# EAGLE design Word Clock (EAGLE 7.2.0)
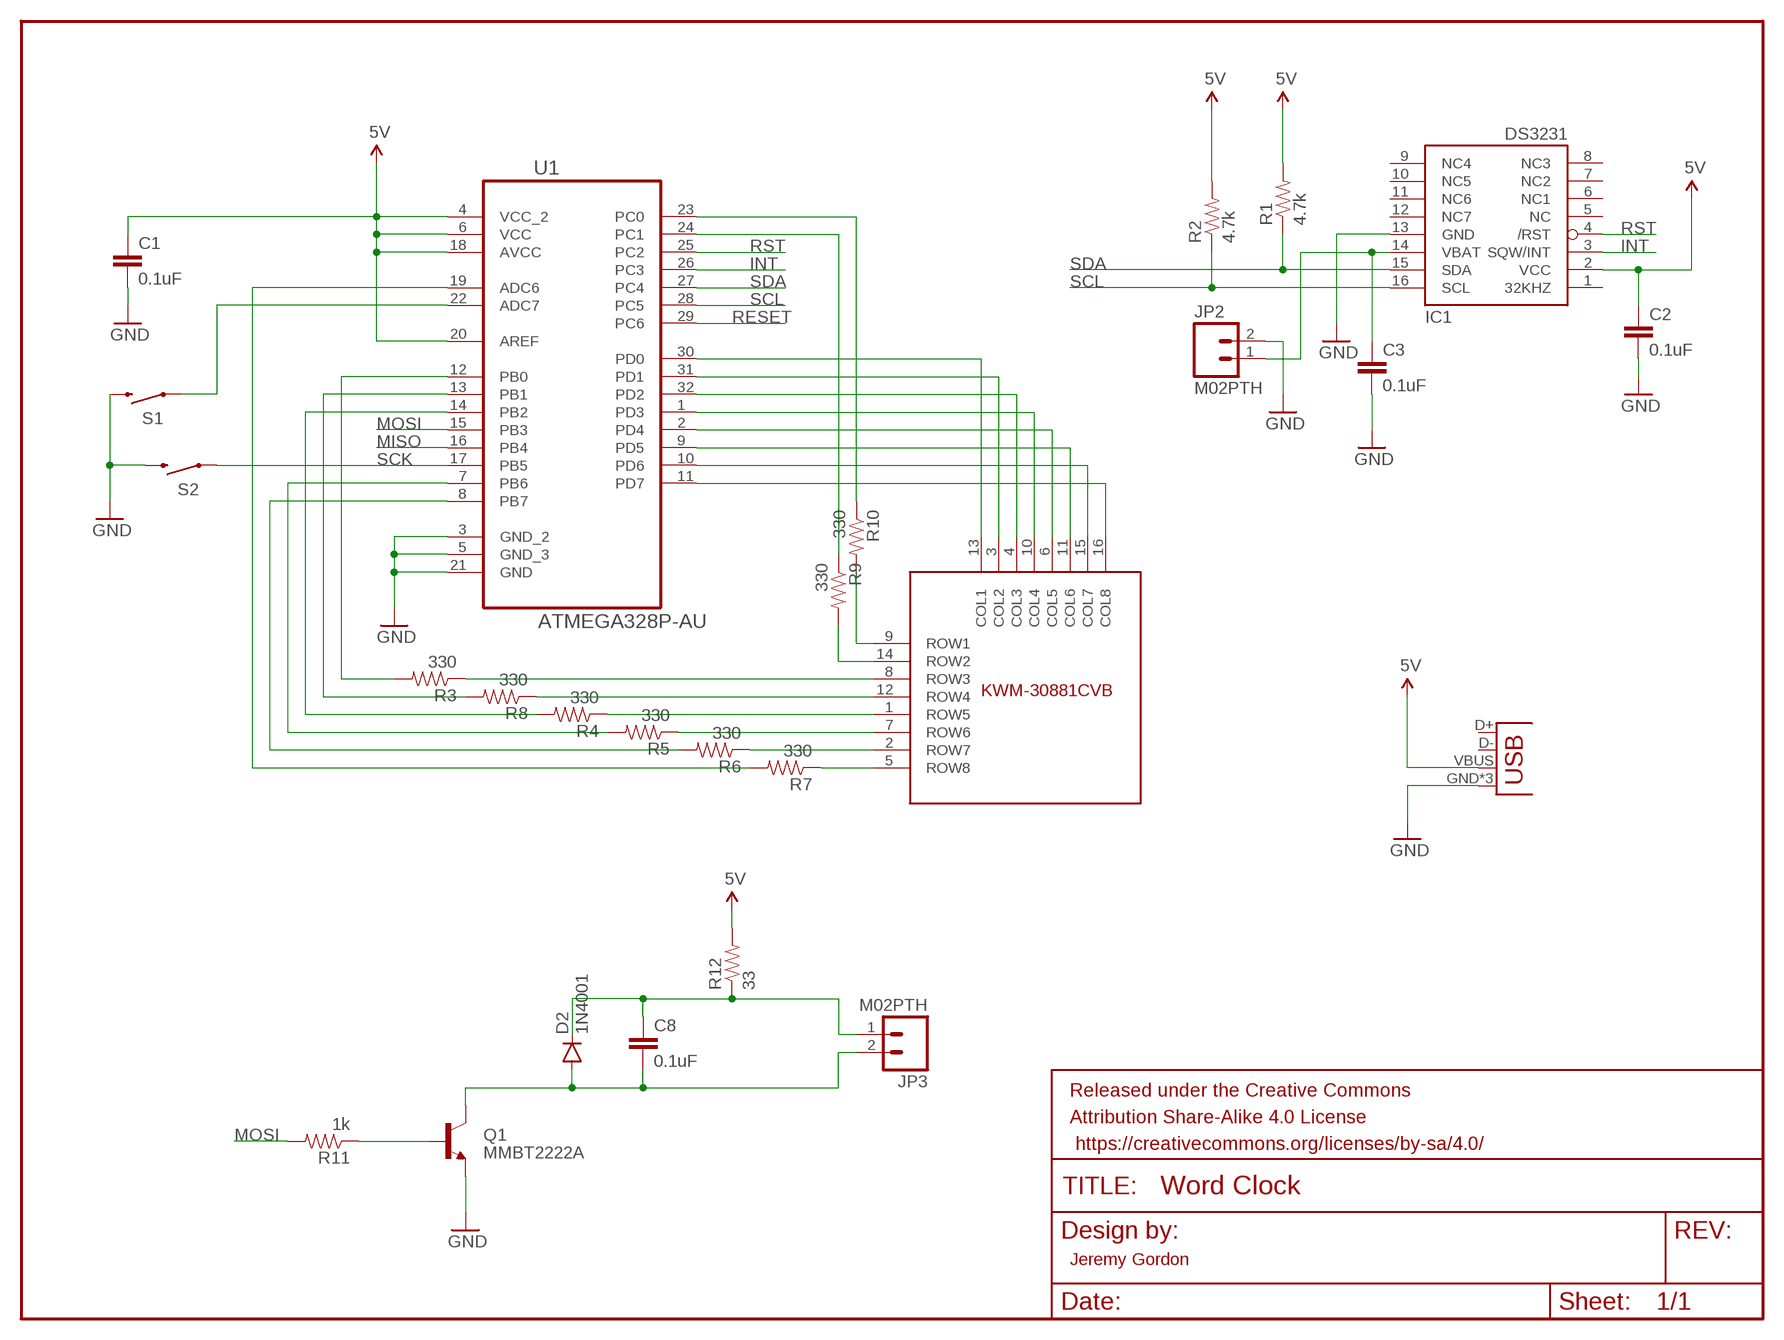
[diagram p0: schematic, sheet 1]

## Parts
C1  0.1uF  CAP0805  [0805]
C2  0.1uF  CAP0805  [0805]
C3  0.1uF  CAP0805  [0805]
C8  0.1uF  CAP0805  [0805]
D1  KWM-30881CVB  [KWM-30881CVB]
D2  1N4001  DIODESOD  [SOD-323]
FRAME1  FRAME-LETTER  [CREATIVE_COMMONS]
IC1  DS3231/SO  [SO16W]
JP1  USB-MICROB  [USB-MICROB]
JP2  M02PTH  [1X02]
JP3  M02PTH  [1X02]
Q1  MMBT2222A  TRANSISTOR_NPNMMBT2222A  [SOT23-3]
R1  4.7k  RESISTOR0805-RES  [0805]
R2  4.7k  RESISTOR0805-RES  [0805]
R3  330  RESISTOR0805-RES  [0805]
R4  330  RESISTOR0805-RES  [0805]
R5  330  RESISTOR0805-RES  [0805]
R6  330  RESISTOR0805-RES  [0805]
R7  330  RESISTOR0805-RES  [0805]
R8  330  RESISTOR0805-RES  [0805]
R9  330  RESISTOR0805-RES  [0805]
R10  330  RESISTOR0805-RES  [0805]
R11  1k  RESISTOR0805-RES  [0805]
R12  33  RESISTOR0805-RES  [0805]
S1  SWITCH-MOMENTARY-2SMD-1101NE  [TACTILE-SWITCH-1101NE]
S2  SWITCH-MOMENTARY-2SMD-1101NE  [TACTILE-SWITCH-1101NE]
U1  ATMEGA328P-AU  [QFP80P900X900X120-32N]

## Nets
5V: C1.1 C2.1 IC1.2(VCC) JP1.VBUS R1.2 R2.2 R12.2 U1.4(VCC_2) U1.6(VCC) U1.18(AVCC) U1.20(AREF)
GND: C1.2 C2.2 C3.2 IC1.13(GND) JP1.GND JP1.MT1(GND) JP1.MT2(GND) JP2.2 Q1.2(E) S1.2 S2.2 U1.3(GND_2) U1.5(GND_3) U1.21(GND)
INT: IC1.3(SQW/INT) U1.26(PC3)
MISO: U1.16(PB4)
MOSI: R11.2 U1.15(PB3)
N$1: D1.13(COL1) U1.30(PD0)
N$2: D1.3(COL2) U1.31(PD1)
N$3: D1.4(COL3) U1.32(PD2)
N$4: D1.10(COL4) U1.1(PD3)
N$5: D1.6(COL5) U1.2(PD4)
N$6: D1.11(COL6) U1.9(PD5)
N$7: D1.15(COL7) U1.10(PD6)
N$8: D1.16(COL8) U1.11(PD7)
N$9: R9.1 U1.24(PC1)
N$10: R10.1 U1.23(PC0)
N$11: R3.2 U1.12(PB0)
N$12: R8.2 U1.13(PB1)
N$13: R4.2 U1.14(PB2)
N$14: R5.2 U1.7(PB6)
N$15: R6.2 U1.8(PB7)
N$16: R7.2 U1.19(ADC6)
N$17: C3.1 IC1.14(VBAT) JP2.1
N$18: S1.1 U1.22(ADC7)
N$19: D1.8(ROW3) R3.1
N$20: D1.12(ROW4) R8.1
N$21: D1.1(ROW5) R4.1
N$22: D1.7(ROW6) R5.1
N$23: D1.2(ROW7) R6.1
N$24: D1.5(ROW8) R7.1
N$25: D1.9(ROW1) R10.2
N$26: D1.14(ROW2) R9.2
N$27: Q1.1(B) R11.1
N$28: C8.1 D2.C JP3.1 R12.1
N$29: C8.2 D2.A JP3.2 Q1.3(C)
RESET: U1.29(PC6)
RST: IC1.4(/RST) U1.25(PC2)
SCK: S2.1 U1.17(PB5)
SCL: IC1.16(SCL) R2.1 U1.28(PC5)
SDA: IC1.15(SDA) R1.1 U1.27(PC4)
Unconnected: IC1.1(32KHZ) IC1.5(NC) IC1.6(NC1) IC1.7(NC2) IC1.8(NC3) IC1.9(NC4) IC1.10(NC5) IC1.11(NC6) IC1.12(NC7) JP1.D+ JP1.D-

## Notes on the sheet
- Jeremy Gordon

## Library data of the parts
C1-C3 C8 = SparkFun-Capacitors:CAP: Capacitor Standard 0603 ceramic capacitor, and 0.1" leaded capacitor.
D1 = KWM-30881XVB:KWM-30881CVB
D2 = SparkFun-DiscreteSemi:DIODE: Diode These are standard reverse protection diodes and small signal diodes. SMA package can handle up to about 1A. SOD-323 can handle about 200mA. What the SOD-323 package when ordering, there are some mfgs out there that are 5-pin packages.; PROD_ID: DIO-09646
FRAME1 = SparkFun-Aesthetics:FRAME-LETTER: Schematic Frame Standard 8.5x11 US Letter frame
IC1 = adafruit:DS3231
JP1 = SparkFun-Connectors:USB: USB Connectors USB-B-PTH is fully proven SKU : PRT-00139/CONN-08278 USB-miniB is fully proven SKU : PRT-00587 USB-A-PCB is untested. USB-A-H is throughly reviewed, but untested. Spark Fun Electronics SKU : PRT-00437 USB-B-SMT is throughly reviewed, but untested. Needs silkscreen touching up. USB-A-S has not been used/tested USB-MB-H has not been used/tested USB-MICROB has been used. CONN-09505; PROD_ID: CONN-09505
JP2 JP3 = SparkFun-Connectors:M02: Standard 2-pin 0.1" header. Use with - straight break away headers ( PRT-00116) - right angle break away headers (PRT-00553) - swiss pins (PRT-00743) - machine pins (PRT-00117) - female headers (PRT-00115) Molex polarized connector foot print use with: PRT-08233 with associated crimp pins and housings. 2.54_SCREWTERM for use with PRT-10571. 3.5mm Screw Terminal footprints for PRT-08084 5mm Screw Terminal footprints for use with PRT-08432
Q1 = SparkFun-DiscreteSemi:TRANSISTOR_NPN: Generic NPN BJT MMBT2222A - TRANS-08049 (SOT-23, 1A 40V) MPSA42 - TRANS-09116 (SOT-23, 500mA 300V) MMBT5088LT1G - TRANS-11160 (SOT-23, 50 mA 30V) BC547 - COM-08928 <http://www.sparkfun.com/products/8928> (TO-92 45V 100mA) (1.Collector 2.Base 3.Emitter) 2N3904 - COM-00521 <http://www.sparkfun.com/products/521> (TO-92 40V 200mA) (1.Emitter 2.Base 3.Collector) P2N2222A - COM-12852 <http://www.sparkfun.com/products/12852> (TO-92 40V 600mA) (1.Collector 2.Base 3.Emitter); PROD_ID: TRANS-08049
R1-R12 = SparkFun-Resistors:RESISTOR: Resistor Basic schematic elements and footprints for 0603, 1206, and PTH resistors.
S1 S2 = SparkFun-Electromechanical:SWITCH-MOMENTARY-2: Various NO switches- pushbuttons, reed, etc; PROD_ID: SWCH-00815
U1 = Atmel_By_element14_Batch_1-00:ATMEGA328P-AU: 8-bit Microcontroller with In-System Programmable Flash; MPN: ATMEGA328P-AU; OC_FARNELL: 1715486; OC_NEWARK: 14R4631; PACKAGE: TQFP-32; SUPPLIER: Atmel

## Board
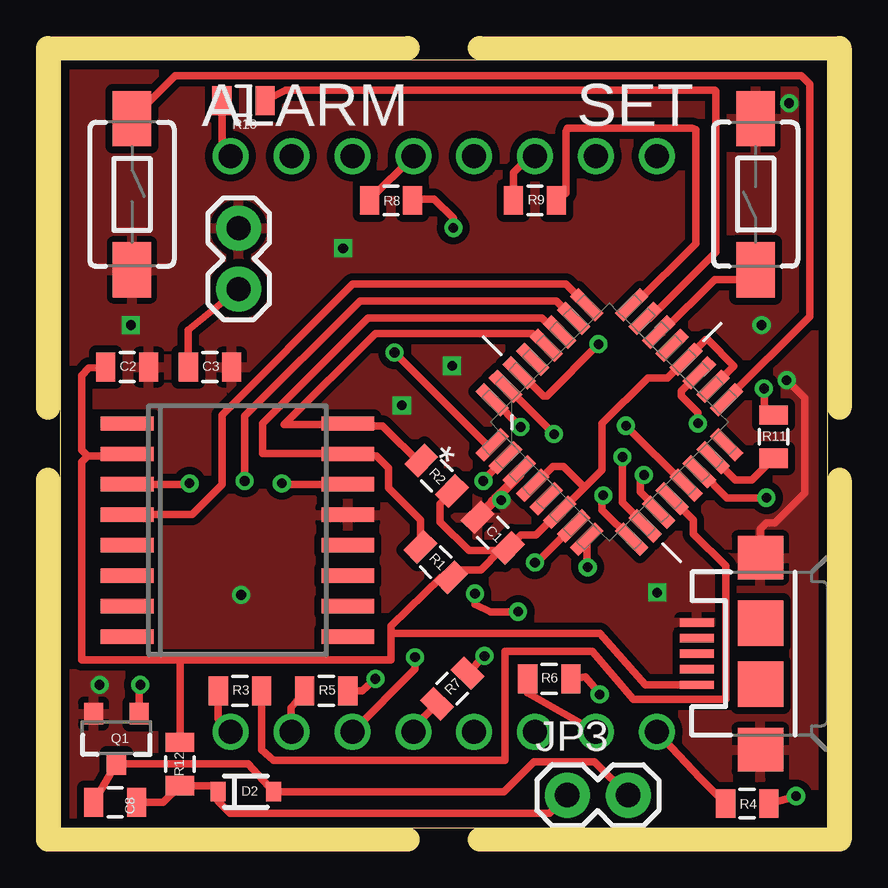
[diagram p1: board, top side]
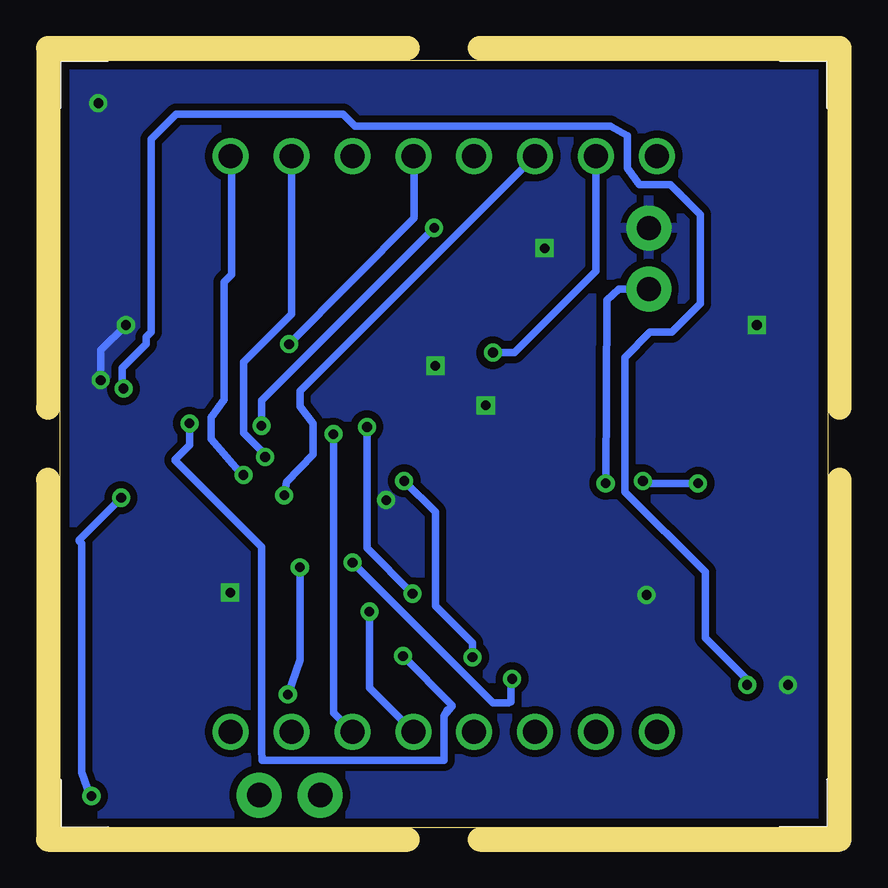
[diagram p2: board, bottom side, seen from below]

Size 32 x 32 mm. Coordinates in mm from the lower left corner, seen from the top.
Outline: 0,0 32,0 32,32 0,32 0,0
Copper layers (1*16): Top 0.0356mm / dielectric 1.5011mm / Bottom 0.0356mm
Design rules "LaenPCBOrder *": minimum track width 6mil, minimum drill 13mil, track to track 8mil, track to pad 8mil, pad to pad 8mil, via to via 8mil, smd to smd 8mil, copper to edge 15mil, drill to drill 6mil, minimum pad ring 7mil, minimum via ring 7mil, stop-mask expansion 3mil, vias tented up to drill 0mil, thermal gap 10mil
Milling: 8 lines

### Footprints (pad centres in the part's own frame; a part is rotated, then mirrored left to right if it is on the bottom)
0805 = smd 0.8 x 1.2: 1 -0.9,0; 2 0.9,0
KWM-30881CVB = drill 1: 1 -8.89,-12; 2 -6.35,-12; 3 -3.81,-12; 4 -1.27,-12; 5 1.27,-12; 6 3.81,-12; 7 6.35,-12; 8 8.89,-12; 9 8.89,12; 10 6.35,12; 11 3.81,12; 12 1.27,12; 13 -1.27,12; 14 -3.81,12; 15 -6.35,12; 16 -8.89,12
SOD-323 = smd 0.63 x 0.83: A 1.15,0; C -1.15,0
SO16W = smd 0.6 x 2.2: 1 -4.445,-4.6; 2 -3.175,-4.6; 3 -1.905,-4.6; 4 -0.635,-4.6; 5 0.635,-4.6; 6 1.905,-4.6; 7 3.175,-4.6; 8 4.445,-4.6; 9 4.445,4.6; 10 3.175,4.6; 11 1.905,4.6; 12 0.635,4.6; 13 -0.635,4.6; 14 -1.905,4.6; 15 -3.175,4.6; 16 -4.445,4.6
USB-MICROB = smd 0.35 x 1.4: D+ 0,2.65; D- -0.65,2.65; GND 1.3,2.65; ID 0.65,2.65; VBUS -1.3,2.65 | smd 1.8 x 1.9: MT1 -4,0; MT2 4,0 | smd 1.9 x 1.9: P$1 -1.27,0; P$2 1.27,0
1X02 = drill 1.016 pad 1.88: 1 0,0; 2 2.54,0
SOT23-3 = smd 0.8 x 0.9: 1 -0.95,-1; 2 0.95,-1; 3 0,1.1
TACTILE-SWITCH-1101NE = smd 2.3 x 1.6: 1 -3.15,0; 2 3.15,0
QFP80P900X900X120-32N = smd 1.473 x 0.508: 1 -4.115,2.794; 2 -4.115,2.007; 3 -4.115,1.194; 4 -4.115,0.406; 5 -4.115,-0.406; 6 -4.115,-1.194; 7 -4.115,-2.007; 8 -4.115,-2.794; 17 4.115,-2.794; 18 4.115,-2.007; 19 4.115,-1.194; 20 4.115,-0.406; 21 4.115,0.406; 22 4.115,1.194; 23 4.115,2.007; 24 4.115,2.794 | smd 0.508 x 1.473: 9 -2.794,-4.115; 10 -2.007,-4.115; 11 -1.194,-4.115; 12 -0.406,-4.115; 13 0.406,-4.115; 14 1.194,-4.115; 15 2.007,-4.115; 16 2.794,-4.115; 25 2.794,4.115; 26 2.007,4.115; 27 1.194,4.115; 28 0.406,4.115; 29 -0.406,4.115; 30 -1.194,4.115; 31 -2.007,4.115; 32 -2.794,4.115

### Placement (x,y rotation side)
C1  18.05,12.3 135 top
C2  2.8,19.2 0 top
C3  6.25,19.2 0 top
C8  2.3,1.05 180 top
D1  16,16 0 bottom
D2  7.75,1.5 0 top
FRAME1  -14.47,-12.39 0 top  (outside the outline)
IC1  7.4,12.4 270 top
JP1  29.2,7.25 90 top
JP2  7.45,22.45 90 top
JP3  21.15,1.35 0 top
Q1  2.35,3.75 180 top
R1  15.66,11.07 315 top
R2  15.7,14.67 315 top
R3  7.5,5.7 0 top
R4  28.65,1 0 top
R5  11.1,5.7 0 top
R6  20.4,6.2 0 top
R7  16.35,5.8 45 top
R8  13.8,26.15 0 top
R9  19.8,26.15 180 top
R10  7.65,30.3 180 top
R11  29.75,16.3 270 top
R12  5,2.65 90 top
S1  29,26.4 90 top
S2  3,26.4 270 top
U1  22.9,16.9 45 top

### Tracks (layer width: path | path; a pad name or v marks a point on that pad's centre or on a via)
5V
  Top 0.305: U1.18 28.1,19.25 27,20.35 26.93,20.35 U1.20 | U1.20 26.07,19.52 | 21.87,14.18 22.6,14.91 22.6,16.85 24.5,18.75 25.32,18.75 U1.20 | 21.87,14.18 U1.6 20.8,13.15 19.85,12.2 19.22,12.2 C1.1 18.46,11.66 18.35,11.55 | U1.4 19.78,14.28 20.55,15.05 21,15.05 21.87,14.18 | JP1.VBUS 24.4,5.95 22.5,8.1 13.8,8.1 | IC1.2 2.73,15.5 1.15,15.5 | 1.15,15.5 0.9,15.25 0.9,7 5,7 | 5,7 13.8,7 13.8,8.1 | 13.8,8.1 13.8,8.4 15.88,10.43 R1.2 16.61,10.75 17.55,10.75 18.35,11.55 | 18.35,11.55 17.05,11.55 15.85,12.75 15.85,13.5 16.34,13.99 R2.2 | C2.1 1.2,19.15 0.9,18.85 0.9,15.75 1.15,15.5 | R12.2 5,7
GND  (via drill 0.4)
  Top 0.305: JP1.MT2 29.2,12.45 29.45,12.7 29.8,12.7 31.05,13.95 31.05,17.9 v30.3,18.65 | v29.25,20.95 29.1,20.95
  Top 0.406: U1.3 19.15,14.7 18.05,13.6 18.05,13.57 C1.2
  Bottom 0.305: v30.3,18.65 30.3,19.9 v29.25,20.95
  other vias: 24.9,9.8 18.4,13.65 7.55,9.7 30.4,30.2 1.65,5.95 2.95,20.95 11.8,24.15 14.25,17.6 16.35,19.25
  pour Top (isolate 0.3): 0,32 0,0 32,0 32,32
  pour Bottom (isolate 0.3): 0,32 32,32 32,0 0,0
INT  (via drill 0.4)
  Top 0.305: IC1.3 5.36,14.3 v5.4,14.35 | v7.7,14.45 7.7,17.15 12.5,21.95 20.69,21.95 U1.26
  Bottom 0.305: v5.4,14.35 7.6,14.35 v7.7,14.45
MOSI
  Top 0.305: U1.15 28.15,14.5 28.85,14.5 R11.2
N$1  (via drill 0.4)
  Top 0.305: U1.30 19.18,18.96 20.15,18 20.3,18 v22.45,20.15
  Bottom 0.305: v22.45,20.15 17.25,25.4 17.25,27.98 D1.13
N$2  (via drill 0.4)
  Top 0.305: U1.31 18.61,18.39 v20.6,16.4
  Bottom 0.305: v20.6,16.4 20.6,4.79 D1.3
N$3  (via drill 0.4)
  Top 0.305: U1.32 18.07,17.83 v19.2,16.7 | v17.3,9.75 17.3,9.3 17.95,9 v19.1,9
  Bottom 0.305: v19.2,16.7 19.2,11.65 v17.3,9.75 | v19.1,9 19.1,5.83 D1.4
N$4  (via drill 0.4)
  Top 0.305: U1.1 17.78,15.97 v13.95,19.8
  Bottom 0.305: v13.95,19.8 13.05,19.8 9.65,23.2 D1.10
N$5  (via drill 0.4)
  Top 0.305: U1.2 17.65,14.49 v17.65,14.45 | v14.8,7.1 14.8,6.61 D1.6
  Bottom 0.305: v17.65,14.45 16.35,13.15 16.35,9.25 14.8,7.7 v14.8,7.1
N$6  (via drill 0.4)
  Top 0.305: U1.9 22.6,13.25 22.6,13.9 v22.65,13.85
  Bottom 0.305: v22.65,13.85 22.55,14.4 21.45,15.55 21.45,16.85 22,17.55 22,18.19 D1.11
N$7  (via drill 0.4)
  Top 0.305: U1.10 24.39,12.61 23.45,13.55 v23.45,15.45
  Bottom 0.305: v23.45,15.45 23.45,15.55 24.35,16.45 24.35,19.4 22.35,21.4 D1.15
N$8  (via drill 0.4)
  Top 0.305: U1.11 24.96,13.23 24.2,14 24.2,14.55 v24.35,14.7
  Bottom 0.305: v24.35,14.7 24.4,14.7 25.7,16.2 25.7,17.1 25.15,17.85 25.15,22.75 24.85,23.05 24.85,27.96 D1.16
N$9
  Top 0.305: U1.24 23.93,21.79 26.5,24.35 26.5,29.1 26.35,29.15 21.15,29.15 21.1,28.99 21.1,26.45 R9.1
  Top 0.406: U1.24
N$10
  Top 0.305: U1.23 24.58,21.23 27.35,24 27.35,30.7 27.3,30.75 9.4,30.75 R10.1
N$11
  Top 0.305: U1.12 26.4,12.82 26.4,12.25 27.75,10.9 27.75,5.35 23.9,5.35 22.2,7.35 18.55,7.35 18.55,2.8 8.9,2.8 8.41,3.24 8.41,5.61 R3.2
N$12  (via drill 0.4)
  Top 0.305: U1.13 26.1,14.3 26.05,14.3 v23.6,16.75 | v16.4,25 16.4,25.4 15.6,26.2 14.75,26.2 R8.2
  Bottom 0.305: v23.6,16.75 23.6,17.8 v16.4,25
N$13  (via drill 0.4)
  Top 0.305: U1.14 26.71,14.84 27.8,13.75 v29.45,13.75 | v30.69,1.31 R4.2
  Bottom 0.305: v29.45,13.75 31.2,12 31.2,11.95 31.1,11.85 31.1,2.3 30.75,1.3 30.75,1.25 v30.69,1.31
N$14  (via drill 0.4)
  Top 0.305: U1.7 19.89,11.05 v19.8,11.05 | v13.15,6.2 12.6,5.7 R5.2
  Bottom 0.305: v19.8,11.05 13.95,5.2 13.3,5.2 13.2,5.25 13.2,6.2 | 13.2,6.2 13.05,6.1 | 13.1,6.15 v13.15,6.2 13.2,6.2
N$15  (via drill 0.4)
  Top 0.305: v22,10.85 21.97,10.88 U1.8 | v22.5,5.55 22.4,5.7 21.9,6.27 R6.2
  Bottom 0.305: v22.5,5.55 22,7 v22,10.85
N$16  (via drill 0.4)
  Top 0.305: U1.19 26.65,18.95 25.9,18.2 25.9,18 26.6,17.3 v26.6,16.85 | v17.7,7.15 R7.2
  Bottom 0.305: v26.6,16.85 26.6,15.95 27.2,15.35 27.2,15.3 23.6,11.7 23.6,3.25 23.58,2.8 16,2.8 16,4.65 | 15.85,4.9 16,4.65 | 16,4.65 15.65,5.05 15.65,5.1 v17.7,7.15
N$17  (via drill 0.4)
  Top 0.305: IC1.14 9.29,14.3 v9.25,14.35 | C3.1 5.35,20.75 JP2.1
  Bottom 0.305: v9.25,14.35 9.2,22 8.7,22.45 JP2.1
N$18
  Top 0.305: 25.05,20.65 25.1,20.65 27.3,22.85 28.5,22.85 S1.1
  Top 0.406: U1.22 25.05,20.65 | 28.4,22.75 S1.1
N$19
  Top 0.305: R3.1 6.6,4.54 D1.8
N$20
  Top 0.305: R8.1 12.9,26.17 D1.12
N$21
  Top 0.305: R4.1 26.7,2.06 D1.1
N$22
  Top 0.305: R5.1 9.64,4.99 D1.7
N$23
  Top 0.305: R6.1 19.49,5.61 D1.2
N$24
  Top 0.305: D1.5 14.73,4.18 R7.1
N$25
  Top 0.305: R10.2 6.75,28.36 D1.9
N$26
  Top 0.305: D1.14 19.6,28 18.9,27.3 R9.2
N$27  (via drill 0.4)
  Top 0.305: Q1.1 3.3,5.9 v3.35,5.95 | v29.35,18.3 29.36,17.57 R11.1
  Bottom 0.305: v3.35,5.95 3.35,6.15 5.1,7.9 5.1,10.65 8.45,14 8.45,19.6 7.4,20.65 6.5,20.65 5.3,21.85 5.3,25.55 6.55,26.8 7.85,26.8 8.35,27.5 8.35,28.85 9.05,29.25 19.7,29.25 20.2,29.75 27.15,29.75 28.2,28.7 28.2,20.65 28.4,20.45 28.4,20.15 29.4,19.15 29.4,18.5 v29.35,18.3
N$28
  Top 0.305: C8.1 4.3,1.05 R12.1 6.35,1.75 D2.C 6.6,1.1 7.1,0.6 20.4,0.6 JP3.1
N$29
  Top 0.305: C8.2 Q1.3 7.85,2.65 D2.A 18.5,1.5 19.75,2.75 22.29,2.75 JP3.2
RST
  Top 0.305: U1.25 21.1,22.65 12.2,22.65 6.75,17.2 6.75,14.3 5.5,13.05 2.81,13.05 IC1.4
SCK
  Top 0.305: U1.17 31.25,21.3 31.25,31 30.9,31.35 4.8,31.35 S2.1
SCL
  Top 0.305: U1.28 20.2,20.1 19.7,20.6 13.15,20.6 9.35,16.8 11.96,16.8 IC1.16 12.1,16.75 13.45,16.75 15.09,15.11 R2.1
SDA
  Top 0.305: U1.27 20.7,20.65 20.1,21.25 12.85,21.25 8.45,16.85 8.45,15.6 11.97,15.6 IC1.15 12.07,15.5 13.2,15.5 13.7,15 13.7,14.15 15.02,12.83 R1.1

### Text on the board
tNames: ALARM | SET